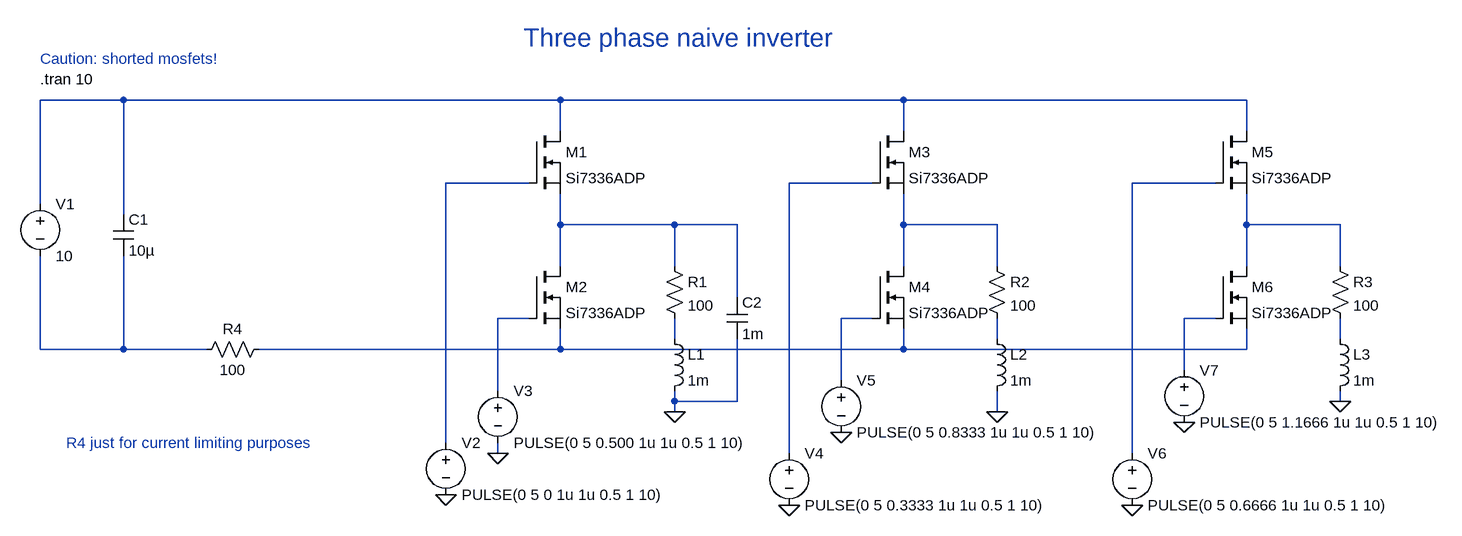
[diagram p0: schematic Three-phase-naive-inverter.asc]
Three-phase-naive-inverter.asc, the LTspice schematic file:
Version 4.1
SHEET 1 1932 680
WIRE -448 -16 -576 -16
WIRE 224 -16 -448 -16
WIRE 752 -16 224 -16
WIRE 1280 -16 752 -16
WIRE 224 32 224 -16
WIRE 752 32 752 -16
WIRE 1280 32 1280 -16
WIRE 176 112 48 112
WIRE 704 112 576 112
WIRE 1232 112 1104 112
WIRE -576 144 -576 -16
WIRE -448 160 -448 -16
WIRE 224 176 224 128
WIRE 400 176 224 176
WIRE 496 176 400 176
WIRE 752 176 752 128
WIRE 896 176 752 176
WIRE 1280 176 1280 128
WIRE 1424 176 1280 176
WIRE 224 240 224 176
WIRE 400 240 400 176
WIRE 752 240 752 176
WIRE 896 240 896 176
WIRE 1280 240 1280 176
WIRE 1424 240 1424 176
WIRE 496 288 496 176
WIRE 176 320 128 320
WIRE 704 320 656 320
WIRE 1232 320 1184 320
WIRE 400 352 400 320
WIRE 896 352 896 320
WIRE 1424 352 1424 320
WIRE -576 368 -576 224
WIRE -448 368 -448 224
WIRE -448 368 -576 368
WIRE -320 368 -448 368
WIRE 224 368 224 336
WIRE 224 368 -240 368
WIRE 752 368 752 336
WIRE 752 368 224 368
WIRE 1280 368 1280 336
WIRE 1280 368 752 368
WIRE 1184 400 1184 320
WIRE 656 416 656 320
WIRE 128 432 128 320
WIRE 400 448 400 432
WIRE 496 448 496 352
WIRE 496 448 400 448
WIRE 1424 448 1424 432
WIRE 400 464 400 448
WIRE 896 464 896 432
WIRE 48 512 48 112
WIRE 128 528 128 512
WIRE 576 528 576 112
WIRE 1104 528 1104 112
FLAG 400 464 0
FLAG 128 528 0
FLAG 48 592 0
FLAG 896 464 0
FLAG 656 496 0
FLAG 576 608 0
FLAG 1424 448 0
FLAG 1184 480 0
FLAG 1104 608 0
SYMBOL nmos 176 32 R0
SYMATTR InstName M1
SYMATTR Value Si7336ADP
SYMBOL nmos 176 240 R0
SYMATTR InstName M2
SYMATTR Value Si7336ADP
SYMBOL cap -464 160 R0
SYMATTR InstName C1
SYMATTR Value 10µ
SYMBOL voltage -576 128 R0
WINDOW 123 0 0 Left 2
WINDOW 39 0 0 Left 2
SYMATTR InstName V1
SYMATTR Value 10
SYMBOL res 384 224 R0
SYMATTR InstName R1
SYMATTR Value 100
SYMBOL ind 384 336 R0
SYMATTR InstName L1
SYMATTR Value 1m
SYMBOL voltage 48 496 R0
WINDOW 123 0 0 Left 2
WINDOW 39 0 0 Left 2
SYMATTR InstName V2
SYMATTR Value PULSE(0 5 0 1u 1u 0.5 1 10)
SYMBOL voltage 128 416 R0
WINDOW 123 0 0 Left 2
WINDOW 39 0 0 Left 2
SYMATTR InstName V3
SYMATTR Value PULSE(0 5 0.500 1u 1u 0.5 1 10)
SYMBOL nmos 704 32 R0
SYMATTR InstName M3
SYMATTR Value Si7336ADP
SYMBOL nmos 704 240 R0
SYMATTR InstName M4
SYMATTR Value Si7336ADP
SYMBOL res 880 224 R0
SYMATTR InstName R2
SYMATTR Value 100
SYMBOL ind 880 336 R0
SYMATTR InstName L2
SYMATTR Value 1m
SYMBOL voltage 576 512 R0
WINDOW 123 0 0 Left 2
WINDOW 39 0 0 Left 2
SYMATTR InstName V4
SYMATTR Value PULSE(0 5 0.3333 1u 1u 0.5 1 10)
SYMBOL voltage 656 400 R0
WINDOW 123 0 0 Left 2
WINDOW 39 0 0 Left 2
SYMATTR InstName V5
SYMATTR Value PULSE(0 5 0.8333 1u 1u 0.5 1 10)
SYMBOL nmos 1232 32 R0
SYMATTR InstName M5
SYMATTR Value Si7336ADP
SYMBOL nmos 1232 240 R0
SYMATTR InstName M6
SYMATTR Value Si7336ADP
SYMBOL res 1408 224 R0
SYMATTR InstName R3
SYMATTR Value 100
SYMBOL ind 1408 336 R0
SYMATTR InstName L3
SYMATTR Value 1m
SYMBOL voltage 1104 512 R0
WINDOW 123 0 0 Left 2
WINDOW 39 0 0 Left 2
SYMATTR InstName V6
SYMATTR Value PULSE(0 5 0.6666 1u 1u 0.5 1 10)
SYMBOL voltage 1184 384 R0
WINDOW 123 0 0 Left 2
WINDOW 39 0 0 Left 2
SYMATTR InstName V7
SYMATTR Value PULSE(0 5 1.1666 1u 1u 0.5 1 10)
SYMBOL res -224 352 R90
WINDOW 0 0 56 VBottom 2
WINDOW 3 32 56 VTop 2
SYMATTR InstName R4
SYMATTR Value 100
SYMBOL cap 480 288 R0
SYMATTR InstName C2
SYMATTR Value 1m
TEXT -576 -48 Left 2 !.tran 10
TEXT -576 -80 Left 2 ;Caution: shorted mosfets!
TEXT -536 512 Left 2 ;R4 just for current limiting purposes
TEXT 168 -112 Left 4 ;Three phase naive inverter

The netlist it stands for:
* Three-phase-naive-inverter.asc
M1 N001 N002 N005 N005 Si7336ADP
M2 N005 N008 N015 N015 Si7336ADP
C1 N001 N014 10µ
V1 N001 N014 10
R1 N005 N011 100
L1 N011 0 1m
V2 N002 0 PULSE(0 5 0 1u 1u 0.5 1 10)
V3 N008 0 PULSE(0 5 0.500 1u 1u 0.5 1 10)
M3 N001 N003 N006 N006 Si7336ADP
M4 N006 N009 N015 N015 Si7336ADP
R2 N006 N012 100
L2 N012 0 1m
V4 N003 0 PULSE(0 5 0.3333 1u 1u 0.5 1 10)
V5 N009 0 PULSE(0 5 0.8333 1u 1u 0.5 1 10)
M5 N001 N004 N007 N007 Si7336ADP
M6 N007 N010 N015 N015 Si7336ADP
R3 N007 N013 100
L3 N013 0 1m
V6 N004 0 PULSE(0 5 0.6666 1u 1u 0.5 1 10)
V7 N010 0 PULSE(0 5 1.1666 1u 1u 0.5 1 10)
R4 N015 N014 100
C2 N005 0 1m
.model NMOS NMOS
.model PMOS PMOS
.lib standard.mos
.tran 10
* Caution: shorted mosfets!
* R4 just for current limiting purposes
* Three phase naive inverter
.backanno
.end